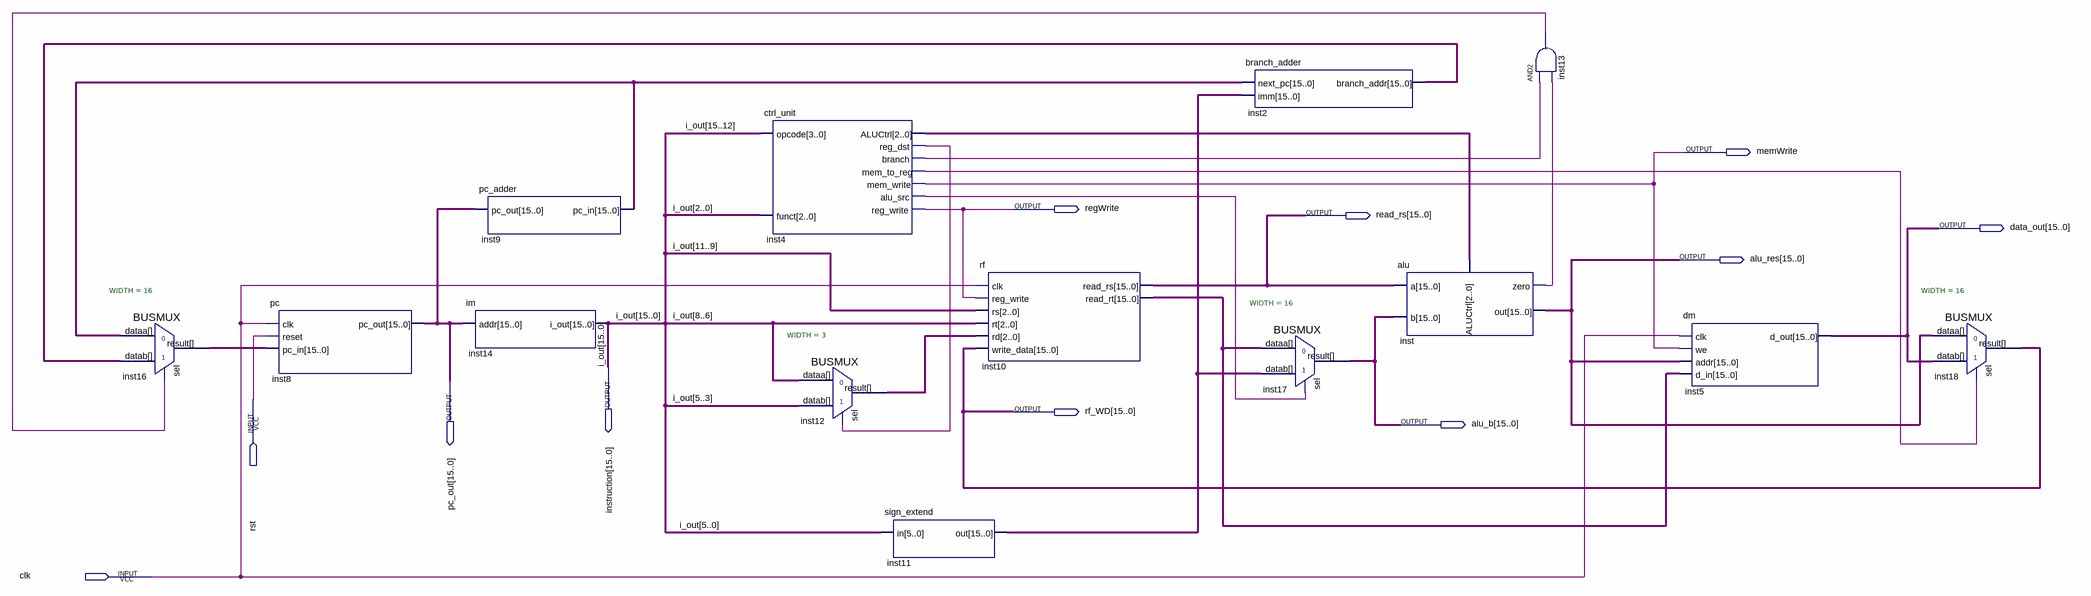
[diagram p0: schematic sheet]
// Quartus schematic processorSC.bdf as structural Verilog: 14 symbols, 11 pins
module processorSC (
  input  rst,
  input  clk,
  output memWrite,
  output regWrite,
  output [15:0] read_rs,
  output [15:0] data_out,
  output [15:0] alu_res,
  output [15:0] instruction,
  output [15:0] pc_out,
  output [15:0] rf_WD,
  output [15:0] alu_b
);

  wire inst4_alu_src, inst4_branch, inst4_mem_to_reg, inst4_reg_dst, inst13_out, inst_zero;
  wire [2:0] inst4_aluctrl, inst12_result;
  wire [15:0] inst2_branch_addr, inst9_pc_in, inst10_read_rt, inst11_out, inst16_result;

  BUSMUX #(.WIDTH(16)) inst16 (
    .datab(inst2_branch_addr), .sel(inst13_out), .dataa(inst9_pc_in), .result(inst16_result));
  pc inst8 (.clk(clk), .reset(rst), .pc_in(inst16_result), .pc_out(pc_out));
  pc_adder inst9 (.pc_out(pc_out), .pc_in(inst9_pc_in));
  im inst14 (.addr(pc_out), .i_out(instruction));
  ctrl_unit inst4 (
    .opcode(instruction[15:12]), .funct(instruction[2:0]), .ALUCtrl(inst4_aluctrl), .reg_dst(inst4_reg_dst),
    .branch(inst4_branch), .mem_to_reg(inst4_mem_to_reg), .mem_write(memWrite), .alu_src(inst4_alu_src),
    .reg_write(regWrite));
  BUSMUX #(.WIDTH(3)) inst12 (
    .datab(instruction[5:3]), .sel(inst4_reg_dst), .dataa(instruction[8:6]), .result(inst12_result));
  sign_extend inst11 (.in(instruction[5:0]), .out(inst11_out));
  rf inst10 (
    .clk(clk), .reg_write(regWrite), .rs(instruction[11:9]), .rt(instruction[8:6]), .rd(inst12_result),
    .write_data(rf_WD), .read_rs(read_rs), .read_rt(inst10_read_rt));
  branch_adder inst2 (.next_pc(inst9_pc_in), .imm(inst11_out), .branch_addr(inst2_branch_addr));
  BUSMUX #(.WIDTH(16)) inst17 (.datab(inst11_out), .sel(inst4_alu_src), .dataa(inst10_read_rt), .result(alu_b));
  alu inst (.a(read_rs), .b(alu_b), .ALUCtrl(inst4_aluctrl), .zero(inst_zero), .out(alu_res));
  and inst13 (inst13_out, inst4_branch, inst_zero);
  dm inst5 (.clk(clk), .we(memWrite), .addr(alu_res), .d_in(inst10_read_rt), .d_out(data_out));
  BUSMUX #(.WIDTH(16)) inst18 (.datab(data_out), .sel(inst4_mem_to_reg), .dataa(alu_res), .result(rf_WD));

  // Other names for the same wires on the sheet: i_out[15:0] = instruction
endmodule
